# EAGLE design HW4 (EAGLE 9.6.2)
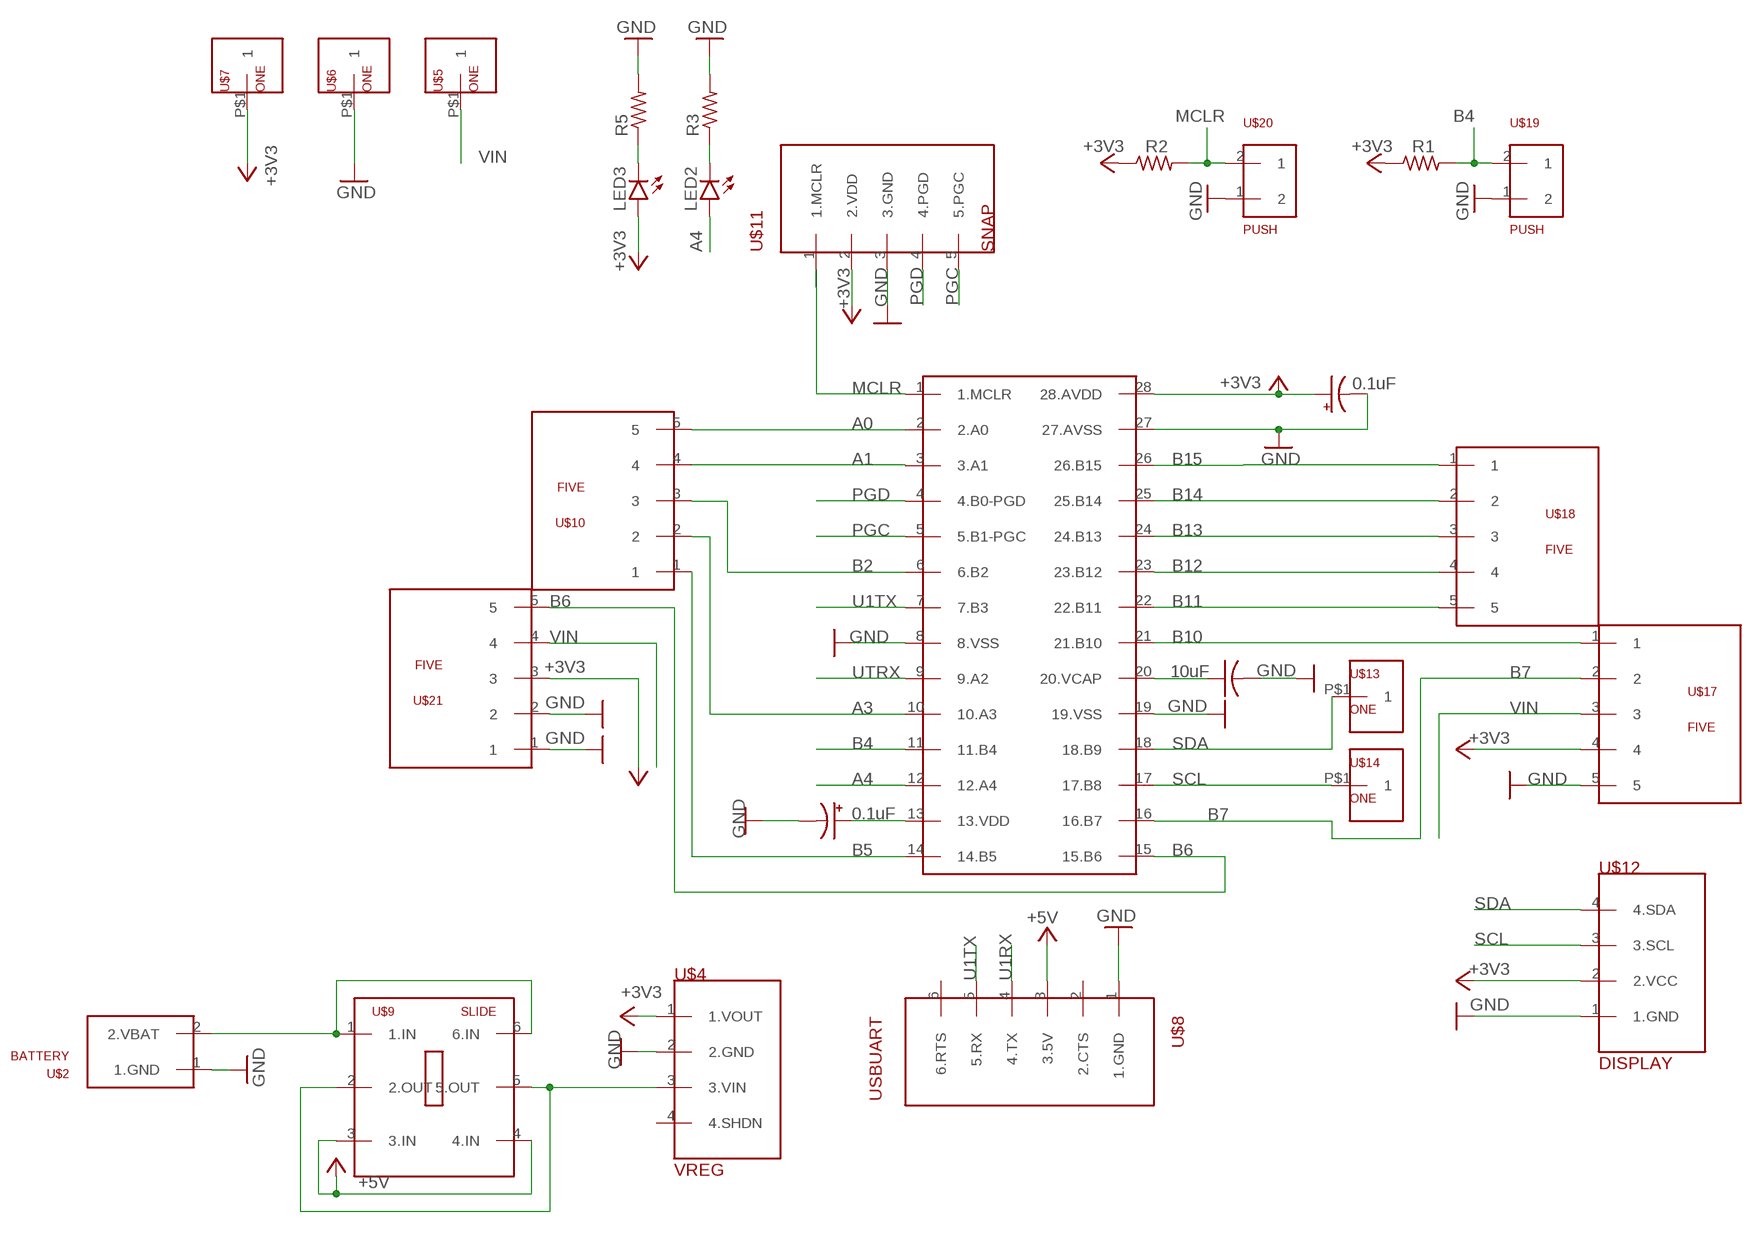
[diagram p0: schematic, sheet 1]

## Parts
C1  10uF  C-US025-030X050  [C025-030X050]
C2  0.1uF  CPOL-USB45181B  [B45181B]
C3  0.1uF  CPOL-USB45181B  [B45181B]
LED2  LED3MM  [LED3MM]
LED3  LED3MM  [LED3MM]
R1  R-US_0207/7  [0207/7]
R2  R-US_0207/7  [0207/7]
R3  R-US_0207/7  [0207/7]
R5  R-US_0207/7  [0207/7]
U$1  PIC32MX170F256B  [DIL28-3]
U$2  BATTERY  [BATTERY]
U$4  VREG  [VREG]
U$5  ONE  [ONE]
U$6  ONE  [ONE]
U$7  ONE  [ONE]
U$8  USBUART  [USBUART]
U$9  SLIDE  [SLIDE]
U$10  FIVE  [FIVE]
U$11  SNAP  [SNAP]
U$12  DISPLAY  [DISPLAY]
U$13  ONE  [ONE]
U$14  ONE  [ONE]
U$17  FIVE  [FIVE]
U$18  FIVE  [FIVE]
U$19  PUSH  [PUSH]
U$20  PUSH  [PUSH]
U$21  FIVE  [FIVE]

## Nets
+3V3: C3.+ LED3.A R1.1 R2.1 U$1.28(28.AVDD) U$4.1(1.VOUT) U$7.P$1 U$11.2(2.VDD) U$12.2(2.VCC) U$17.4 U$21.3
+5V: U$8.3(3.5V) U$9.3(3.IN) U$9.4(4.IN)
A0: U$1.2(2.A0) U$10.5
A1: U$1.3(3.A1) U$10.4
A3: U$1.10(10.A3) U$10.2
A4: LED2.A U$1.12(12.A4)
B2: U$1.6(6.B2) U$10.3
B4: R1.2 U$1.11(11.B4) U$19.2
B5: U$1.14(14.B5) U$10.1
B6: U$1.15(15.B6) U$21.5
B7: U$1.16(16.B7) U$17.2
B10: U$1.21(21.B10) U$17.1
B11: U$1.22(22.B11) U$18.5
B12: U$1.23(23.B12) U$18.4
B13: U$1.24(24.B13) U$18.3
B14: U$1.25(25.B14) U$18.2
B15: U$1.26(26.B15) U$18.1
GND: C1.2 C2.- C3.- R3.2 R5.2 U$1.8(8.VSS) U$1.19(19.VSS) U$1.27(27.AVSS) U$2.1(1.GND) U$4.2(2.GND) U$6.P$1 U$8.1(1.GND) U$11.3(3.GND) U$12.1(1.GND) U$17.5 U$19.1 U$20.1 U$21.1 U$21.2
MCLR: R2.2 U$1.1(1.MCLR) U$11.1(1.MCLR) U$20.2
N$1: C2.+ U$1.13(13.VDD)
N$2: LED3.K(C) R5.1
N$9: C1.1 U$1.20(20.VCAP)
N$13: LED2.K(C) R3.1
N$14: U$2.2(2.VBAT) U$9.1(1.IN) U$9.6(6.IN)
N$16: U$4.3(3.VIN) U$9.2(2.OUT) U$9.5(5.OUT)
PGC: U$1.5(5.B1-PGC) U$11.5(5.PGC)
PGD: U$1.4(4.B0-PGD) U$11.4(4.PGD)
SCL: U$1.17(17.B8) U$12.3(3.SCL) U$14.P$1
SDA: U$1.18(18.B9) U$12.4(4.SDA) U$13.P$1
U1RX: U$8.4(4.TX)
U1TX: U$1.7(7.B3) U$8.5(5.RX)
UTRX: U$1.9(9.A2)
VIN: U$5.P$1 U$17.3 U$21.4
Unconnected: U$4.4(4.SHDN) U$8.2(2.CTS) U$8.6(6.RTS)

## Library data of the parts
C1 = HW4:C-US: CAPACITOR, American symbol; SPICEPREFIX: C
C2 C3 = HW4:CPOL-US: POLARIZED CAPACITOR, American symbol; SPICEPREFIX: C
LED2 LED3 = HW4:LED: LED OSRAM: - CHIPLED LG R971, LG N971, LY N971, LG Q971, LY Q971, LO R971, LY R971 LH N974, LH R974 LS Q976, LO Q976, LY Q976 LO Q996 - Hyper CHIPLED LW Q18S LB Q993, LB Q99A, LB R99A - SideLED LS A670, LO A670, LY A670, LG A670, LP A670 LB A673, LV A673, LT A673, LW A673 LH A674 LY A675 LS A676, LA A676, LO A676, LY A676, LW A676 LS A679, LY A679, LG A679 - Hyper Micro SIDELED® LS Y876, LA Y876, LO Y876, LY Y876 LT Y87S - SmartLED LW L88C, LW L88S LB L89C, LB L89S, LG L890 LS L89K, LO L89K, LY L89K LS L896, LA L896, LO L896, LY L896 - TOPLED LS T670, LO T670, LY T670, LG T670, LP T670 LSG T670, LSP T670, LSY T670, LOP T670, LYG T670 LG T671, LOG T671, LSG T671 LB T673, LV T673, LT T673, LW T673 LH T674 LS T676, LA T676, LO T676, LY T676, LB T676, LH T676, LSB T676, LW T676 LB T67C, LV T67C, LT T67C, LS T67K, LO T67K, LY T67K, LW E67C LS E67B, LA E67B, LO E67B, LY E67B, LB E67C, LV E67C, LT E67C LW T67C LS T679, LY T679, LG T679 LS T770, LO T770, LY T770, LG T770, LP T770 LB T773, LV T773, LT T773, LW T773 LH T774 LS E675, LA E675, LY E675, LS T675 LS T776, LA T776, LO T776, LY T776, LB T776 LHGB T686 LT T68C, LB T68C - Hyper Mini TOPLED® LB M676 - Mini TOPLED Santana® LG M470 LS M47K, LO M47K, LY M47K Source: http://www.osram.convergy.de LUXEON: - LUMILED® LXK2-PW12-R00, LXK2-PW12-S00, LXK2-PW14-U00, LXK2-PW14-V00 LXK2-PM12-R00, LXK2-PM12-S00, LXK2-PM14-U00 LXK2-PE12-Q00, LXK2-PE12-R00, LXK2-PE12-S00, LXK2-PE14-T00, LXK2-PE14-U00 LXK2-PB12-K00, LXK2-PB12-L00, LXK2-PB12-M00, LXK2-PB14-N00, LXK2-PB14-P00, LXK2-PB14-Q00 LXK2-PR12-L00, LXK2-PR12-M00, LXK2-PR14-Q00, LXK2-PR14-R00 LXK2-PD12-Q00, LXK2-PD12-R00, LXK2-PD12-S00 LXK2-PH12-R00, LXK2-PH12-S00 LXK2-PL12-P00, LXK2-PL12-Q00, LXK2-PL12-R00 Source: www.luxeon.com KINGBRIGHT: KA-3528ASYC Source: www.kingbright.com
R1-R3 R5 = HW4:R-US_: RESISTOR, American symbol; SPICEPREFIX: R
U$1 = HW4:PIC32MX170F256B
U$2 = HW4:BATTERY
U$4 = HW4:VREG
U$5-U$7 U$13 U$14 = HW4:ONE
U$8 = HW4:USBUART
U$9 = HW4:SLIDE
U$10 U$17 U$18 U$21 = HW4:FIVE
U$11 = HW4:SNAP
U$12 = HW4:DISPLAY
U$19 U$20 = HW4:PUSH

## Board
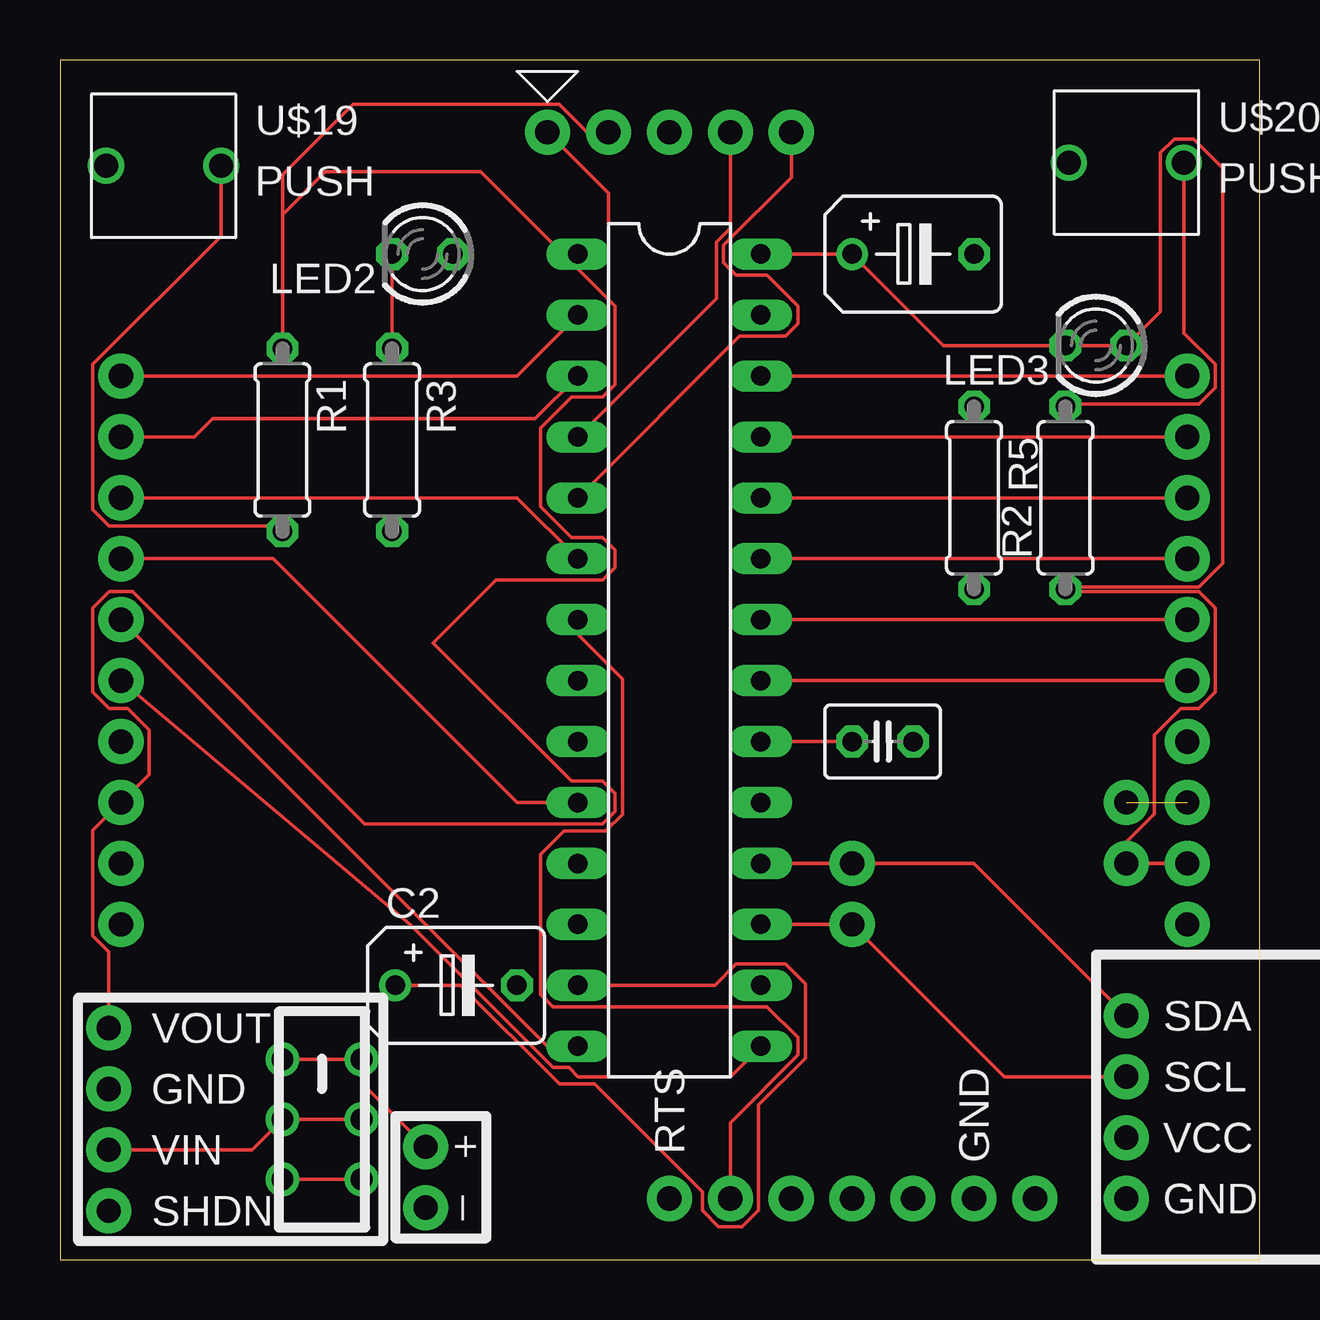
[diagram p1: board, top side]
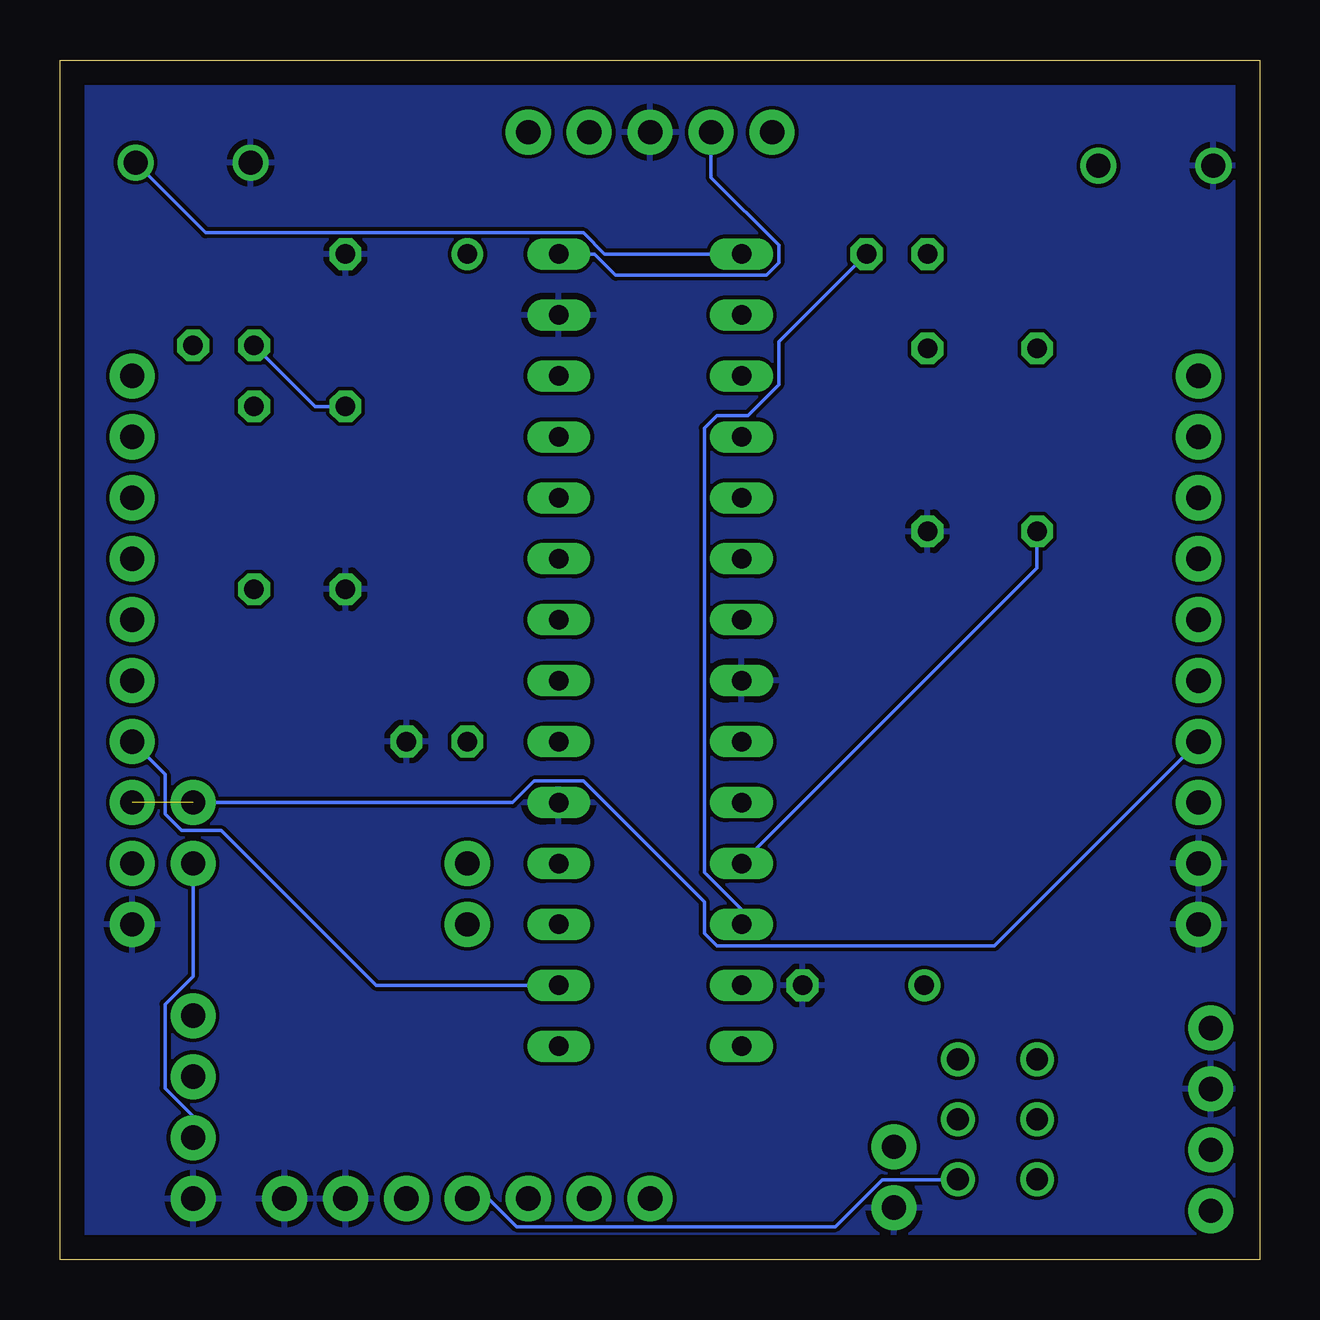
[diagram p2: board, bottom side, seen from below]

Size 50 x 50 mm. Coordinates in mm from the lower left corner, seen from the top.
Outline: 0,0 50,0 50,50 0,50 0,0
Copper layers (1*16): Top 0.035mm / dielectric 1.5mm / Bottom 0.035mm
Design rules "default": minimum track width 6mil, minimum drill 0.35mm, track to track 6mil, track to pad 6mil, pad to pad 6mil, via to via 6mil, smd to smd 6mil, copper to edge 40mil, drill to drill 6mil, minimum pad ring 10mil, minimum via ring 8mil, stop-mask expansion 4mil, vias tented up to drill 0mil, thermal gap 10mil

### Footprints (pad centres in the part's own frame; a part is rotated, then mirrored left to right if it is on the bottom)
C025-030X050 = drill 0.813 octagon: 1 -1.27,0; 2 1.27,0
B45181B = drill 0.813: + -2.54,0 | drill 0.813 octagon: - 2.54,0
LED3MM = drill 0.813 octagon: A -1.27,0; K 1.27,0
0207/7 = drill 0.813 octagon: 1 -3.81,0; 2 3.81,0
DIL28-3 = drill 0.813 long: 1 -16.51,-3.81; 2 -13.97,-3.81; 3 -11.43,-3.81; 4 -8.89,-3.81; 5 -6.35,-3.81; 6 -3.81,-3.81; 7 -1.27,-3.81; 8 1.27,-3.81; 9 3.81,-3.81; 10 6.35,-3.81; 11 8.89,-3.81; 12 11.43,-3.81; 13 13.97,-3.81; 14 16.51,-3.81; 15 16.51,3.81; 16 13.97,3.81; 17 11.43,3.81; 18 8.89,3.81; 19 6.35,3.81; 20 3.81,3.81; 21 1.27,3.81; 22 -1.27,3.81; 23 -3.81,3.81; 24 -6.35,3.81; 25 -8.89,3.81; 26 -11.43,3.81; 27 -13.97,3.81; 28 -16.51,3.81
BATTERY = drill 1.016 pad 1.88: 1 -1.27,0; 2 1.27,0
VREG = drill 1.016 pad 1.88: 1 -3.81,0; 2 -1.27,0; 3 1.27,0; 4 3.81,0
ONE = drill 1.016 pad 1.88: P$1 0,0
USBUART = drill 1.016 pad 1.88: 1 -6.35,0; 2 -3.81,0; 3 -1.27,0; 4 1.27,0; 5 3.81,0; 6 6.35,0
SLIDE = drill 0.9: 1 -2.5,-1.65; 2 0,-1.65; 3 2.5,-1.65; 4 2.5,1.65; 5 0,1.65; 6 -2.5,1.65
FIVE = drill 1.016 pad 1.88: 1 -5.08,0; 2 -2.54,0; 3 0,0; 4 2.54,0; 5 5.08,0
SNAP = drill 1.016 pad 1.88: 1 -5.08,0; 2 -2.54,0; 3 0,0; 4 2.54,0; 5 5.08,0
DISPLAY = drill 1.016 pad 1.88: 1 0,-3.81; 2 0,-1.27; 3 0,1.27; 4 0,3.81
PUSH = drill 1: 1 -2.4,0; 2 2.4,0

### Placement (x,y rotation side)
C1  34.29,21.59 0 top
C2  16.51,11.43 0 top
C3  35.56,41.91 0 top
LED2  15.11,41.91 180 top
LED3  43.18,38.1 180 top
R1  9.27,34.16 270 top
R2  41.91,31.75 90 top
R3  13.84,34.16 270 top
R5  38.1,31.75 270 top
U$1  25.4,25.4 270 top
U$2  15.24,3.43 90 top
U$4  2.03,5.84 270 top
U$5  44.45,19.05 0 top
U$6  40.64,2.54 0 top
U$7  44.45,16.51 0 top
U$8  31.75,2.54 180 top
U$9  10.92,5.84 270 top
U$10  2.54,31.75 90 top
U$11  25.4,46.99 0 top
U$12  44.45,6.35 0 top
U$13  33.02,16.51 0 top
U$14  33.02,13.97 0 top
U$17  46.99,19.05 270 top
U$18  46.99,31.75 270 top
U$19  4.32,45.59 0 top
U$20  44.45,45.72 0 top
U$21  2.54,19.05 90 top

### Tracks (layer width: path | path; a pad name or v marks a point on that pad's centre or on a via)
+3V3
  Top 0.152: U$1.28 C3.+ 36.83,38.1 LED3.A 45.87,39.52 45.87,46.13 46.44,46.7 47.26,46.7 48.46,45.5 48.46,29.03 47.47,28.04 42.22,28.04 42.01,27.84 | U$11.2 21.97,46.99 20.8,48.16 12.22,48.16 9.27,45.21 R1.1 9.27,43.55 11.06,45.34 17.54,45.34 23.14,39.74 23.14,36.46 22.62,35.94 21.32,35.94 20.04,34.66 20.04,31.38 21.32,30.1 22.62,30.1 23.14,29.58 23.14,28.84 22.62,28.32 18.17,28.32 15.56,25.7 21.32,19.94 22.62,19.94 23.14,19.42 23.14,18.68 22.62,18.16 12.7,18.16 3.02,27.84 2.06,27.84 1.37,27.15 1.37,23.65 2.06,22.96 2.82,22.96 3.71,22.07 3.71,20.22 U$21.3 1.37,17.88 1.37,13.49 2.03,12.83 U$4.1 | R2.1 42.01,27.84 | 42.01,27.84 47.47,27.84 48.16,27.15 48.16,23.65 47.47,22.96 46.71,22.96 45.62,21.87 45.62,18.57 44.45,17.4 U$7.P$1 U$17.4
  Bottom 0.152: U$1.28 27.72,41.91 26.83,41.02 20.56,41.02 20.04,41.54 20.04,42.28 22.86,45.1 U$11.2 | U$7.P$1 44.45,11.81 45.62,10.64 45.62,7.14 44.45,5.97 U$12.2
+5V
  Top 0.152: U$9.3 U$9.4
  Bottom 0.152: U$8.3 32.13,2.54 30.96,1.37 17.68,1.37 15.72,3.33 12.59,3.33 U$9.4
A0
  Top 0.152: U$1.2 19.05,36.83 U$10.5
A1
  Top 0.152: U$10.4 5.6,34.29 6.36,35.05 19.81,35.05 U$1.3
A3
  Top 0.152: U$10.2 8.89,29.21 19.05,19.05 U$1.10
A4
  Bottom 0.152: LED2.A 20.04,38.25 20.04,36.46 21.32,35.18 22.62,35.18 23.14,34.66 23.14,16.14 21.59,14.59 U$1.12
B2
  Top 0.152: U$10.3 19.05,31.75 U$1.6
B4
  Top 0.152: U$19.2 6.72,42.66 1.37,37.31 1.37,31.27 2.06,30.58 9.04,30.58 R1.2
  Bottom 0.152: R1.2 9.27,28.83 U$1.11
B5
  Top 0.152: U$10.1 20.32,8.89 U$1.14
B6
  Top 0.152: U$21.5 14.59,13.97 20.56,8 21.21,8 21.59,7.62 27.94,7.62 U$1.15
B7
  Bottom 0.152: U$1.16 36.83,11.43 43.28,17.88 44.93,17.88 45.62,18.57 45.62,20.22 U$17.2
B10
  Top 0.152: U$1.21 U$17.1
B11
  Top 0.152: U$1.22 U$18.5
B12
  Top 0.152: U$1.23 U$18.4
B13
  Top 0.152: U$1.24 U$18.3
B14
  Top 0.152: U$1.25 U$18.2
B15
  Top 0.152: U$1.26 U$18.1
GND
  pour Bottom: 0,50.8 50.8,50.8 50.8,0 0,0
MCLR
  Top 0.152: U$11.1 22.86,44.45 22.86,41.91 U$1.1 | R2.2 42.01,35.66 47.47,35.66 48.16,36.35 48.16,37.31 46.85,38.62 U$20.2
  Bottom 0.152: U$1.1 27.29,41.91 28.18,42.8 43.93,42.8 U$20.2
N$1
  Top 0.152: C2.+ 16.7,11.43 20.82,7.32 22.28,7.32 26.77,2.82 26.77,2.06 27.46,1.37 28.42,1.37 29.11,2.06 29.11,6.44 31.06,8.4 31.06,11.49 30.24,12.32 28.18,12.32 27.29,11.43 U$1.13
N$2
  Bottom 0.152: R5.1 39.37,35.56 LED3.K
N$9
  Top 0.152: U$1.20 C1.1
N$13
  Top 0.152: LED2.K R3.1
N$14
  Top 0.152: U$9.1 U$9.6 12.57,7.37 U$2.2
N$16
  Top 0.152: U$9.5 U$9.2 8,4.57 U$4.3
PGC
  Top 0.152: U$1.5 28.32,38.48 30.24,38.48 30.76,39 30.76,39.74 29.48,41.02 28.18,41.02 27.66,41.54 27.66,42.28 30.48,45.1 U$11.5
PGD
  Top 0.152: U$11.4 27.94,42.99 27.36,42.4 27.36,40.06 U$1.4
SCL
  Top 0.152: U$1.17 U$14.P$1 39.37,7.62 U$12.3
SDA
  Top 0.152: U$1.18 U$13.P$1 38.1,16.51 U$12.4
U1TX
  Top 0.152: U$1.7 21.59,26.05 23.44,24.19 23.44,18.56 22.75,17.86 21.02,17.86 20.04,16.88 20.04,11.06 20.56,10.54 29.48,10.54 30.76,9.26 30.76,8.52 27.94,5.7 U$8.5
VIN  (1 unrouted)
  Bottom 0.152: U$5.P$1 31.13,19.05 30.24,19.94 28.18,19.94 23.14,14.9 23.14,13.6 22.62,13.08 11.05,13.08 U$21.4